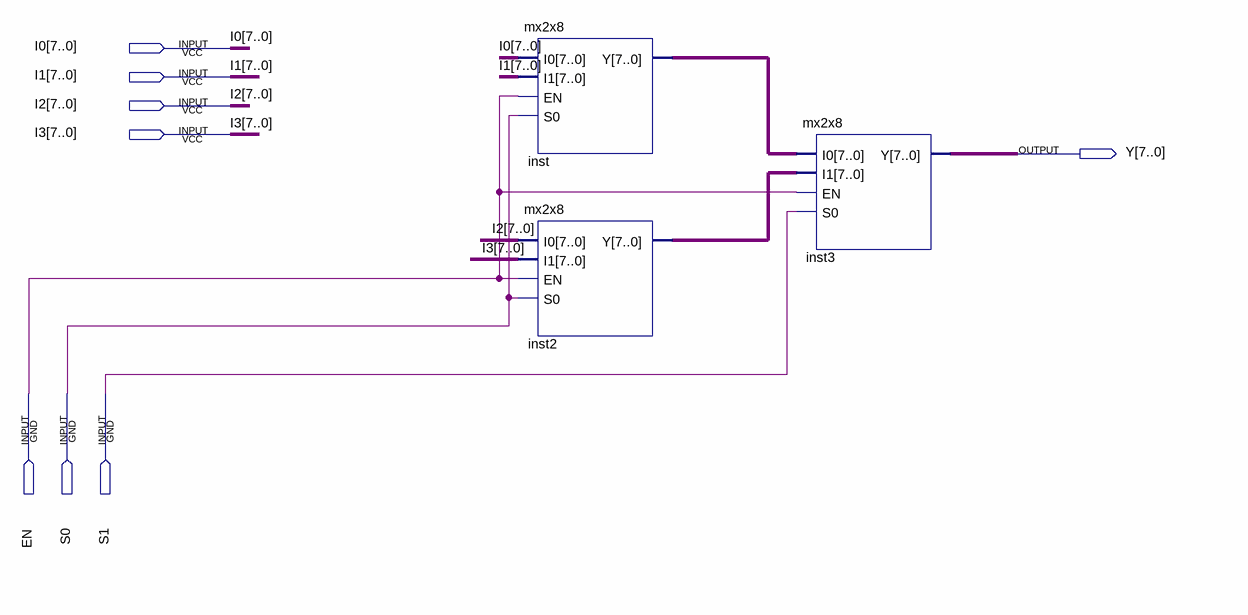
[diagram p0: schematic sheet]
// Quartus schematic mx4x8.bdf as structural Verilog: 3 symbols, 8 pins
module mx4x8 (
  input  [7:0] I0,
  input  [7:0] I1,
  input  [7:0] I2,
  input  [7:0] I3,
  input  EN,
  input  S0,
  input  S1,
  output [7:0] Y
);

  wire [7:0] inst2_y, inst_y;

  mx2x8 inst (.I0(I0), .I1(I1), .EN(EN), .S0(S0), .Y(inst_y));
  mx2x8 inst2 (.I0(I2), .I1(I3), .EN(EN), .S0(S0), .Y(inst2_y));
  mx2x8 inst3 (.I0(inst_y), .I1(inst2_y), .EN(EN), .S0(S1), .Y(Y));
endmodule
